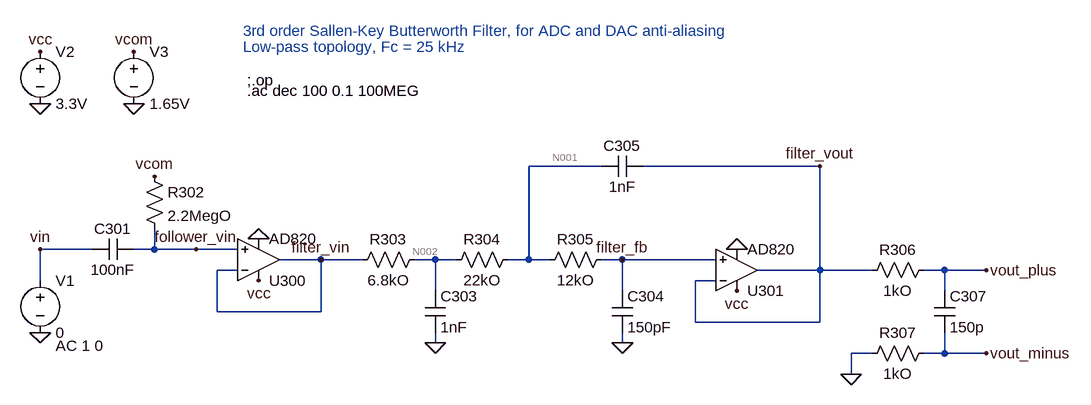
[diagram p0: schematic 3rd_order_bw_filter.asc]
3rd_order_bw_filter.asc, the LTspice schematic file:
Version 4
SHEET 1 1688 680
WIRE 848 16 736 16
WIRE 1184 16 912 16
WIRE 64 144 -16 144
WIRE 160 144 160 112
WIRE 160 144 128 144
WIRE 224 144 160 144
WIRE 288 144 224 144
WIRE 416 160 352 160
WIRE 480 160 416 160
WIRE 592 160 560 160
WIRE 624 160 592 160
WIRE 736 160 736 16
WIRE 736 160 704 160
WIRE 768 160 736 160
WIRE 880 160 848 160
WIRE 1024 160 880 160
WIRE 288 176 256 176
WIRE 1184 176 1184 16
WIRE 1184 176 1088 176
WIRE 1264 176 1184 176
WIRE 1376 176 1344 176
WIRE 1440 176 1376 176
WIRE -16 192 -16 144
WIRE 1024 192 992 192
WIRE 592 208 592 160
WIRE 880 208 880 160
WIRE 1376 208 1376 176
WIRE 256 240 256 176
WIRE 416 240 416 160
WIRE 416 240 256 240
WIRE 992 256 992 192
WIRE 1184 256 1184 176
WIRE 1184 256 992 256
WIRE 592 288 592 272
WIRE 880 288 880 272
WIRE 1264 304 1232 304
WIRE 1376 304 1376 272
WIRE 1376 304 1344 304
WIRE 1440 304 1376 304
WIRE 1232 336 1232 304
FLAG -16 -80 0
FLAG -16 272 0
FLAG 320 128 0
FLAG 1056 144 0
FLAG 1056 208 vcc
FLAG 320 192 vcc
FLAG -16 -160 vcc
FLAG -16 144 vin
FLAG 160 32 vcom
FLAG 880 288 0
FLAG 592 288 0
FLAG 1184 16 filter_vout
FLAG 416 160 filter_vin
FLAG 224 144 follower_vin
FLAG 880 160 filter_fb
FLAG 1232 336 0
FLAG 1440 176 vout_plus
FLAG 1440 304 vout_minus
FLAG 128 -80 0
FLAG 128 -160 vcom
SYMBOL cap 128 128 R90
WINDOW 0 0 32 VBottom 2
WINDOW 3 32 32 VTop 2
SYMATTR InstName C301
SYMATTR Value 100nF
SYMBOL res 144 16 R0
SYMATTR InstName R302
SYMATTR Value 2.2MegO
SYMBOL OpAmps\\AD820 320 224 M180
SYMATTR InstName U300
SYMBOL OpAmps\\AD820 1056 240 M180
SYMATTR InstName U301
SYMBOL voltage -16 176 R0
WINDOW 123 24 116 Left 2
WINDOW 39 0 0 Left 0
SYMATTR InstName V1
SYMATTR Value 0
SYMATTR Value2 AC 1 0
SYMBOL voltage -16 -176 R0
SYMATTR InstName V2
SYMATTR Value 3.3V
SYMBOL res 576 144 R90
WINDOW 0 0 56 VBottom 2
WINDOW 3 32 56 VTop 2
SYMATTR InstName R303
SYMATTR Value 6.8kO
SYMBOL res 720 144 R90
WINDOW 0 0 56 VBottom 2
WINDOW 3 32 56 VTop 2
SYMATTR InstName R304
SYMATTR Value 22kO
SYMBOL res 864 144 R90
WINDOW 0 0 56 VBottom 2
WINDOW 3 32 56 VTop 2
SYMATTR InstName R305
SYMATTR Value 12kO
SYMBOL cap 864 208 R0
SYMATTR InstName C304
SYMATTR Value 150pF
SYMBOL cap 576 208 R0
SYMATTR InstName C303
SYMATTR Value 1nF
SYMBOL cap 912 0 R90
WINDOW 0 0 32 VBottom 2
WINDOW 3 32 32 VTop 2
SYMATTR InstName C305
SYMATTR Value 1nF
SYMBOL cap 1360 208 R0
SYMATTR InstName C307
SYMATTR Value 150p
SYMBOL res 1360 160 R90
WINDOW 0 0 56 VBottom 2
WINDOW 3 32 56 VTop 2
SYMATTR InstName R306
SYMATTR Value 1kO
SYMBOL res 1360 288 R90
WINDOW 0 0 56 VBottom 2
WINDOW 3 32 56 VTop 2
SYMATTR InstName R307
SYMATTR Value 1kO
SYMBOL voltage 128 -176 R0
SYMATTR InstName V3
SYMATTR Value 1.65V
TEXT 296 -192 Left 2 ;3rd order Sallen-Key Butterworth Filter, for ADC and DAC anti-aliasing
TEXT 296 -168 Left 2 ;Low-pass topology, Fc = 25 kHz
TEXT 302 -116 Left 2 !;.op
TEXT 302 -100 Left 2 !.ac dec 100 0.1 100MEG

The netlist it stands for:
* 3rd_order_bw_filter.asc
C301 follower_vin vin 100nF
R302 vcom follower_vin 2.2MegO
XU300 follower_vin filter_vin vcc 0 filter_vin AD820  ; pins In+ In- V+ V- OUT
XU301 filter_fb filter_vout vcc 0 filter_vout AD820  ; pins In+ In- V+ V- OUT
V1 vin 0 0 AC 1 0
V2 vcc 0 3.3V
R303 N002 filter_vin 6.8kO
R304 N001 N002 22kO
R305 filter_fb N001 12kO
C304 filter_fb 0 150pF
C303 N002 0 1nF
C305 filter_vout N001 1nF
C307 vout_plus vout_minus 150p
R306 vout_plus filter_vout 1kO
R307 vout_minus 0 1kO
V3 vcom 0 1.65V
* 3rd order Sallen-Key Butterworth Filter, for ADC and DAC anti-aliasing
* Low-pass topology, Fc = 25 kHz
;.op
.ac dec 100 0.1 100MEG
.backanno
.end

* Results of the author's LTspice run, read from the files saved beside the schematic
* Operating Point, zero values left out:
*   V(follower_vin) = 1.65 V
*   V(vcom) = 1.65 V
*   V(vcc) = 3.3 V
*   V(filter_vin) = 1.65 V
*   V(filter_vout) = 1.65 V
*   V(filter_fb) = 1.65 V
*   V(n002) = 1.65 V
*   V(n001) = 1.65 V
*   V(vout_plus) = 1.65 V
*   I(R305) = -2 pA
*   I(R304) = -2 pA
*   I(R303) = -2 pA
*   I(R302) = 2 pA
*   I(V3) = -2 pA
*   I(V2) = -698.6 µA
*   Ix(u300:1) = 2 pA
*   Ix(u300:2) = 2 pA
*   Ix(u300:3) = 349.3 µA
*   Ix(u300:4) = -349.3 µA
*   Ix(u300:5) = -4 pA
*   Ix(u301:1) = 2 pA
*   Ix(u301:2) = 2 pA
*   Ix(u301:3) = 349.3 µA
*   Ix(u301:4) = -349.3 µA
*   Ix(u301:5) = -2 pA
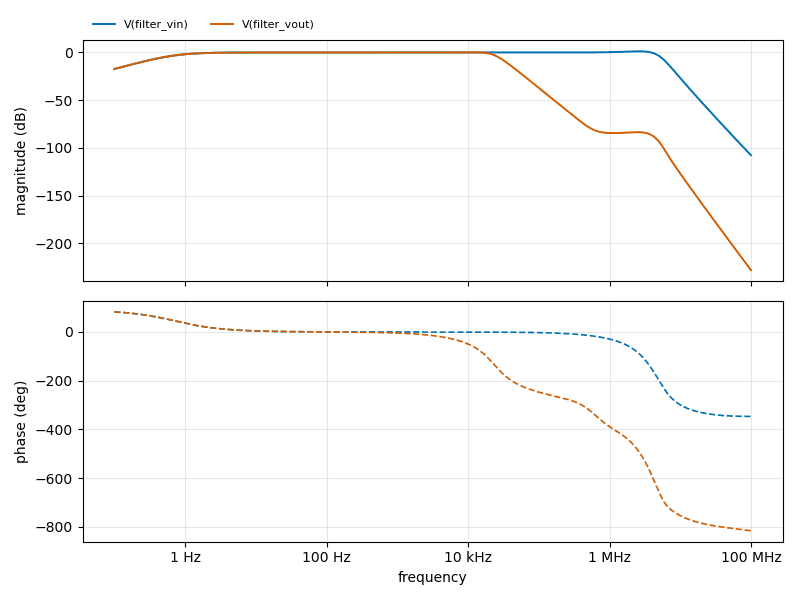
[diagram p1: AC Analysis of 3rd_order_bw_filter.asc, plotted from the saved traces]
* AC Analysis, 1 run:
*   V(filter_vin): -17.27 dB at 100 mHz, -107.62 dB at 100 MHz, peak 1.25 dB at 2.63 MHz, 3 dB below the peak at 1.022 Hz and 4.519 MHz
*   V(filter_vout): -17.27 dB at 100 mHz, -227.98 dB at 100 MHz, peak 0.12 dB at 10.72 kHz, 3 dB below the peak at 744.2 mHz and 23.62 kHz